# EAGLE schematic edition4-mainpart-5 (EAGLE 9.6.2)
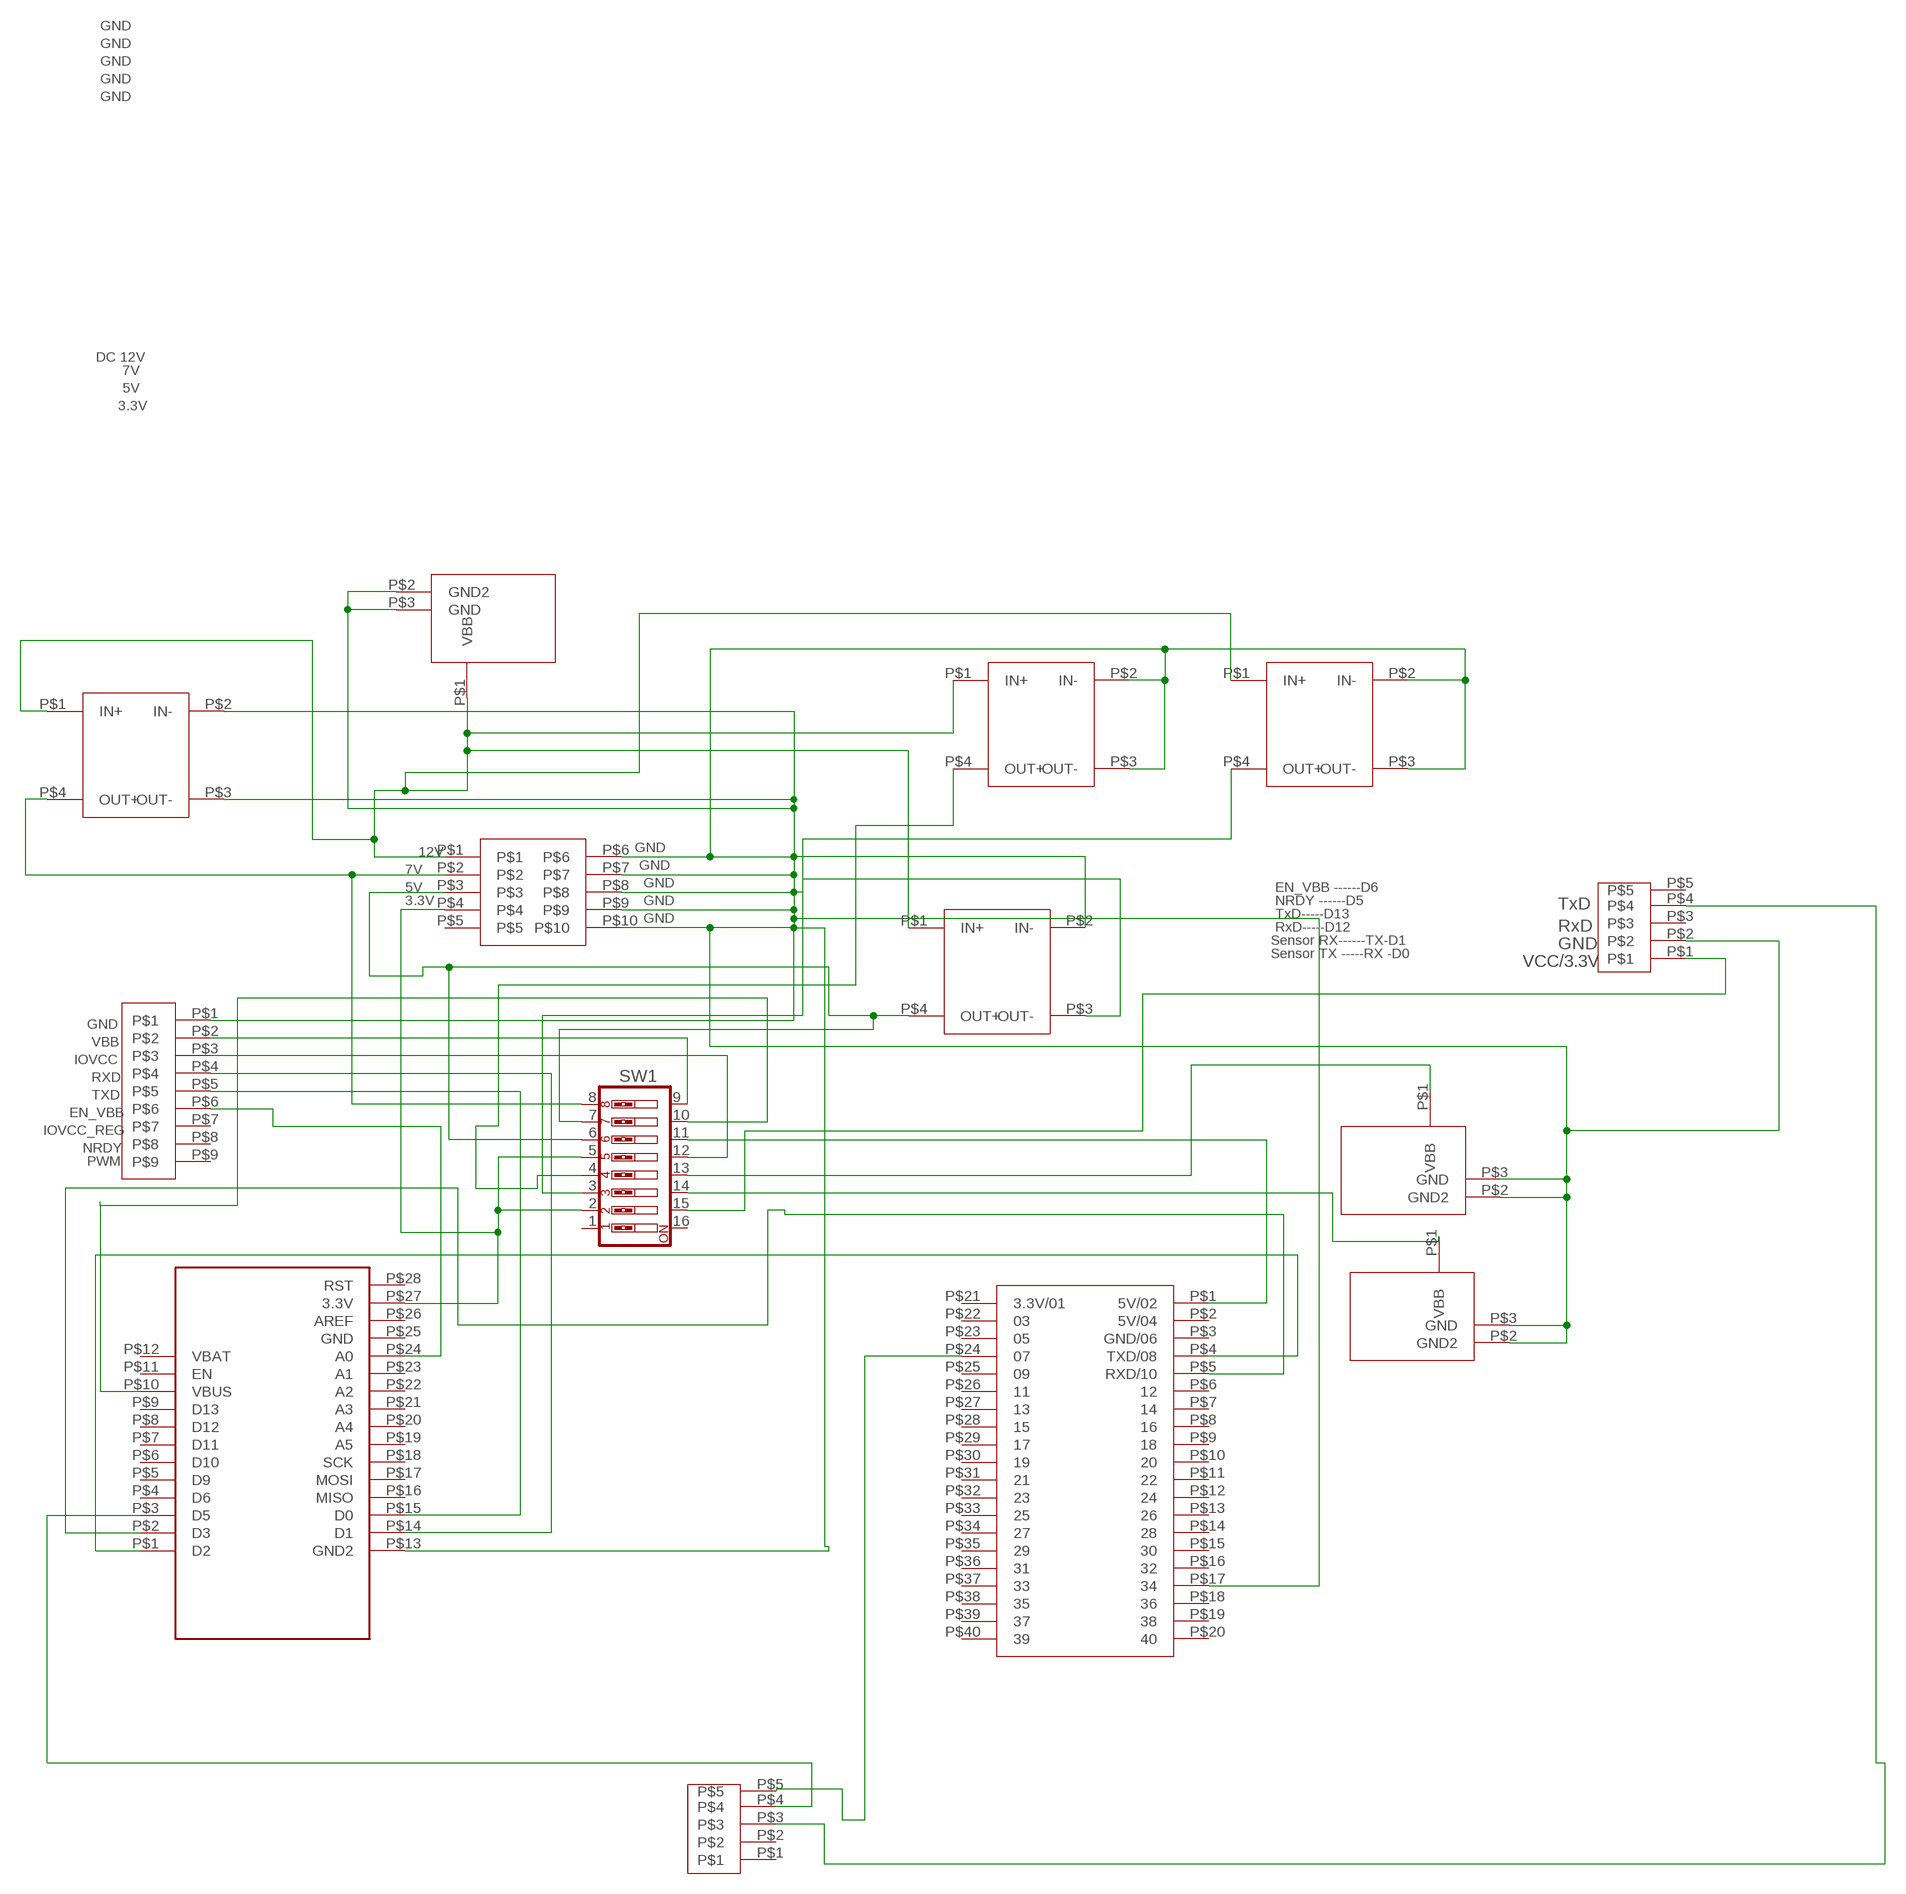
[diagram p0: schematic, sheet 1]

## Parts
SW1  SW_DIP-8  [EDG-08]
U$1  MH-MINI-360  [MH-MINI-360]
U$2  MH-MINI-360  [MH-MINI-360]
U$3  POWER  [POWERIN]
U$4  POWER  [POWERIN]
U$5  POWER  [POWERIN]
U$6  MH-MINI-360  [MH-MINI-360]
U$7  MH-MINI-360  [MH-MINI-360]
U$8  PIN  [PIN]
U$9  PIN  [PIN]
U$10  FEATHER  [FEATHER]
U$11  RASPBERRYPI  [RASPBERRYPI]
U$14  2X5FEET  [2X5FEET]
U$15  9FEETPIN  [9FEETPIN]

## Nets
GND: U$1.P$2(IN-) U$1.P$3(OUT-) U$2.P$2(IN-) U$2.P$3(OUT-) U$3.P$2(GND2) U$3.P$3(GND) U$4.P$2(GND2) U$4.P$3(GND) U$5.P$2(GND2) U$5.P$3(GND) U$6.P$2(IN-) U$6.P$3(OUT-) U$7.P$2(IN-) U$7.P$3(OUT-) U$8.P$2 U$10.P$13(GND2) U$11.P$17 U$14.P$6 U$14.P$7 U$14.P$8 U$14.P$9 U$14.P$10 U$15.P$1
N$1: SW1.10 U$10.P$10(VBUS)
N$2: SW1.3 U$7.P$4(OUT+)
N$3: SW1.2 SW1.5 U$10.P$27(3.3V) U$14.P$4
N$4: SW1.8 U$6.P$4(OUT+) U$14.P$2
N$5: SW1.9 U$15.P$2
N$6: U$8.P$4 U$9.P$3
N$7: SW1.12 U$15.P$3
N$8: U$10.P$14(D1) U$15.P$4
N$9: U$10.P$15(D0) U$15.P$5
N$10: U$9.P$4 U$10.P$3(D5)
N$11: SW1.6 SW1.7 U$2.P$4(OUT+) U$14.P$3
N$12: SW1.11 U$11.P$1(5V/02)
N$13: SW1.15 U$8.P$1
N$14: SW1.13 U$5.P$1(VBB)
N$15: U$10.P$1(D2) U$11.P$4(TXD/08)
N$16: U$10.P$2(D3) U$11.P$5(RXD/10)
N$17: SW1.4 U$1.P$4(OUT+)
N$18: U$1.P$1(IN+) U$2.P$1(IN+) U$3.P$1(VBB) U$6.P$1(IN+) U$7.P$1(IN+) U$14.P$1
N$19: SW1.14 U$4.P$1(VBB)
N$20: U$9.P$5 U$11.P$24
N$21: U$10.P$24(A0) U$15.P$6
Unconnected: SW1.1 SW1.16 U$8.P$3 U$8.P$5 U$9.P$1 U$9.P$2 U$10.P$4(D6) U$10.P$5(D9) U$10.P$6(D10) U$10.P$7(D11) U$10.P$8(D12) U$10.P$9(D13) U$10.P$11(EN) U$10.P$12(VBAT) U$10.P$16(MISO) U$10.P$17(MOSI) U$10.P$18(SCK) U$10.P$19(A5) U$10.P$20(A4) U$10.P$21(A3) U$10.P$22(A2) U$10.P$23(A1) U$10.P$25(GND) U$10.P$26(AREF) U$10.P$28(RST) U$11.P$2(5V/04) U$11.P$3(GND/06) U$11.P$6 U$11.P$7 U$11.P$8 U$11.P$9 U$11.P$10 U$11.P$11 U$11.P$12 U$11.P$13 U$11.P$14 U$11.P$15 U$11.P$16 U$11.P$18 U$11.P$19 U$11.P$20 U$11.P$21(3.3V/01) U$11.P$22 U$11.P$23 U$11.P$25 U$11.P$26 U$11.P$27 U$11.P$28 U$11.P$29 U$11.P$30 U$11.P$31 U$11.P$32 U$11.P$33 U$11.P$34 U$11.P$35 U$11.P$36 U$11.P$37 U$11.P$38 U$11.P$39 U$11.P$40 U$14.P$5 U$15.P$7 U$15.P$8 U$15.P$9

## Notes on the sheet
- GND
- GND
- GND
- GND
- GND
- DC 12V
- 7V
- 5V
- 3.3V
- GND
- 12V
- GND
- 7V
- GND
- 5V | EN_VBB ------D6
- 3.3V | GND | NRDY ------D5
- TxD
- TxD-----D13
- GND
- RxD-----D12 | RxD
- Sensor RX------TX-D1
- GND
- Sensor TX -----RX -D0
- VCC/3.3V
- GND
- VBB
- IOVCC
- RXD
- TXD
- EN_VBB
- IOVCC_REG
- NRDY
- PWM

## Library data of the parts
SW1 = special:SW_DIP-8: DIP SWITCH
U$1 U$2 U$6 U$7 = untitled:MH-MINI-360
U$3-U$5 = untitled:POWER
U$8 = untitled:PIN
U$9 = untitled (1):PIN
U$10 = untitled:FEATHER
U$11 = untitled:RASPBERRYPI
U$14 = untitled:2X5FEET
U$15 = untitled:9FEETPIN